# Altium schematic sheet Motherboard V2.0.SchDoc
size A3
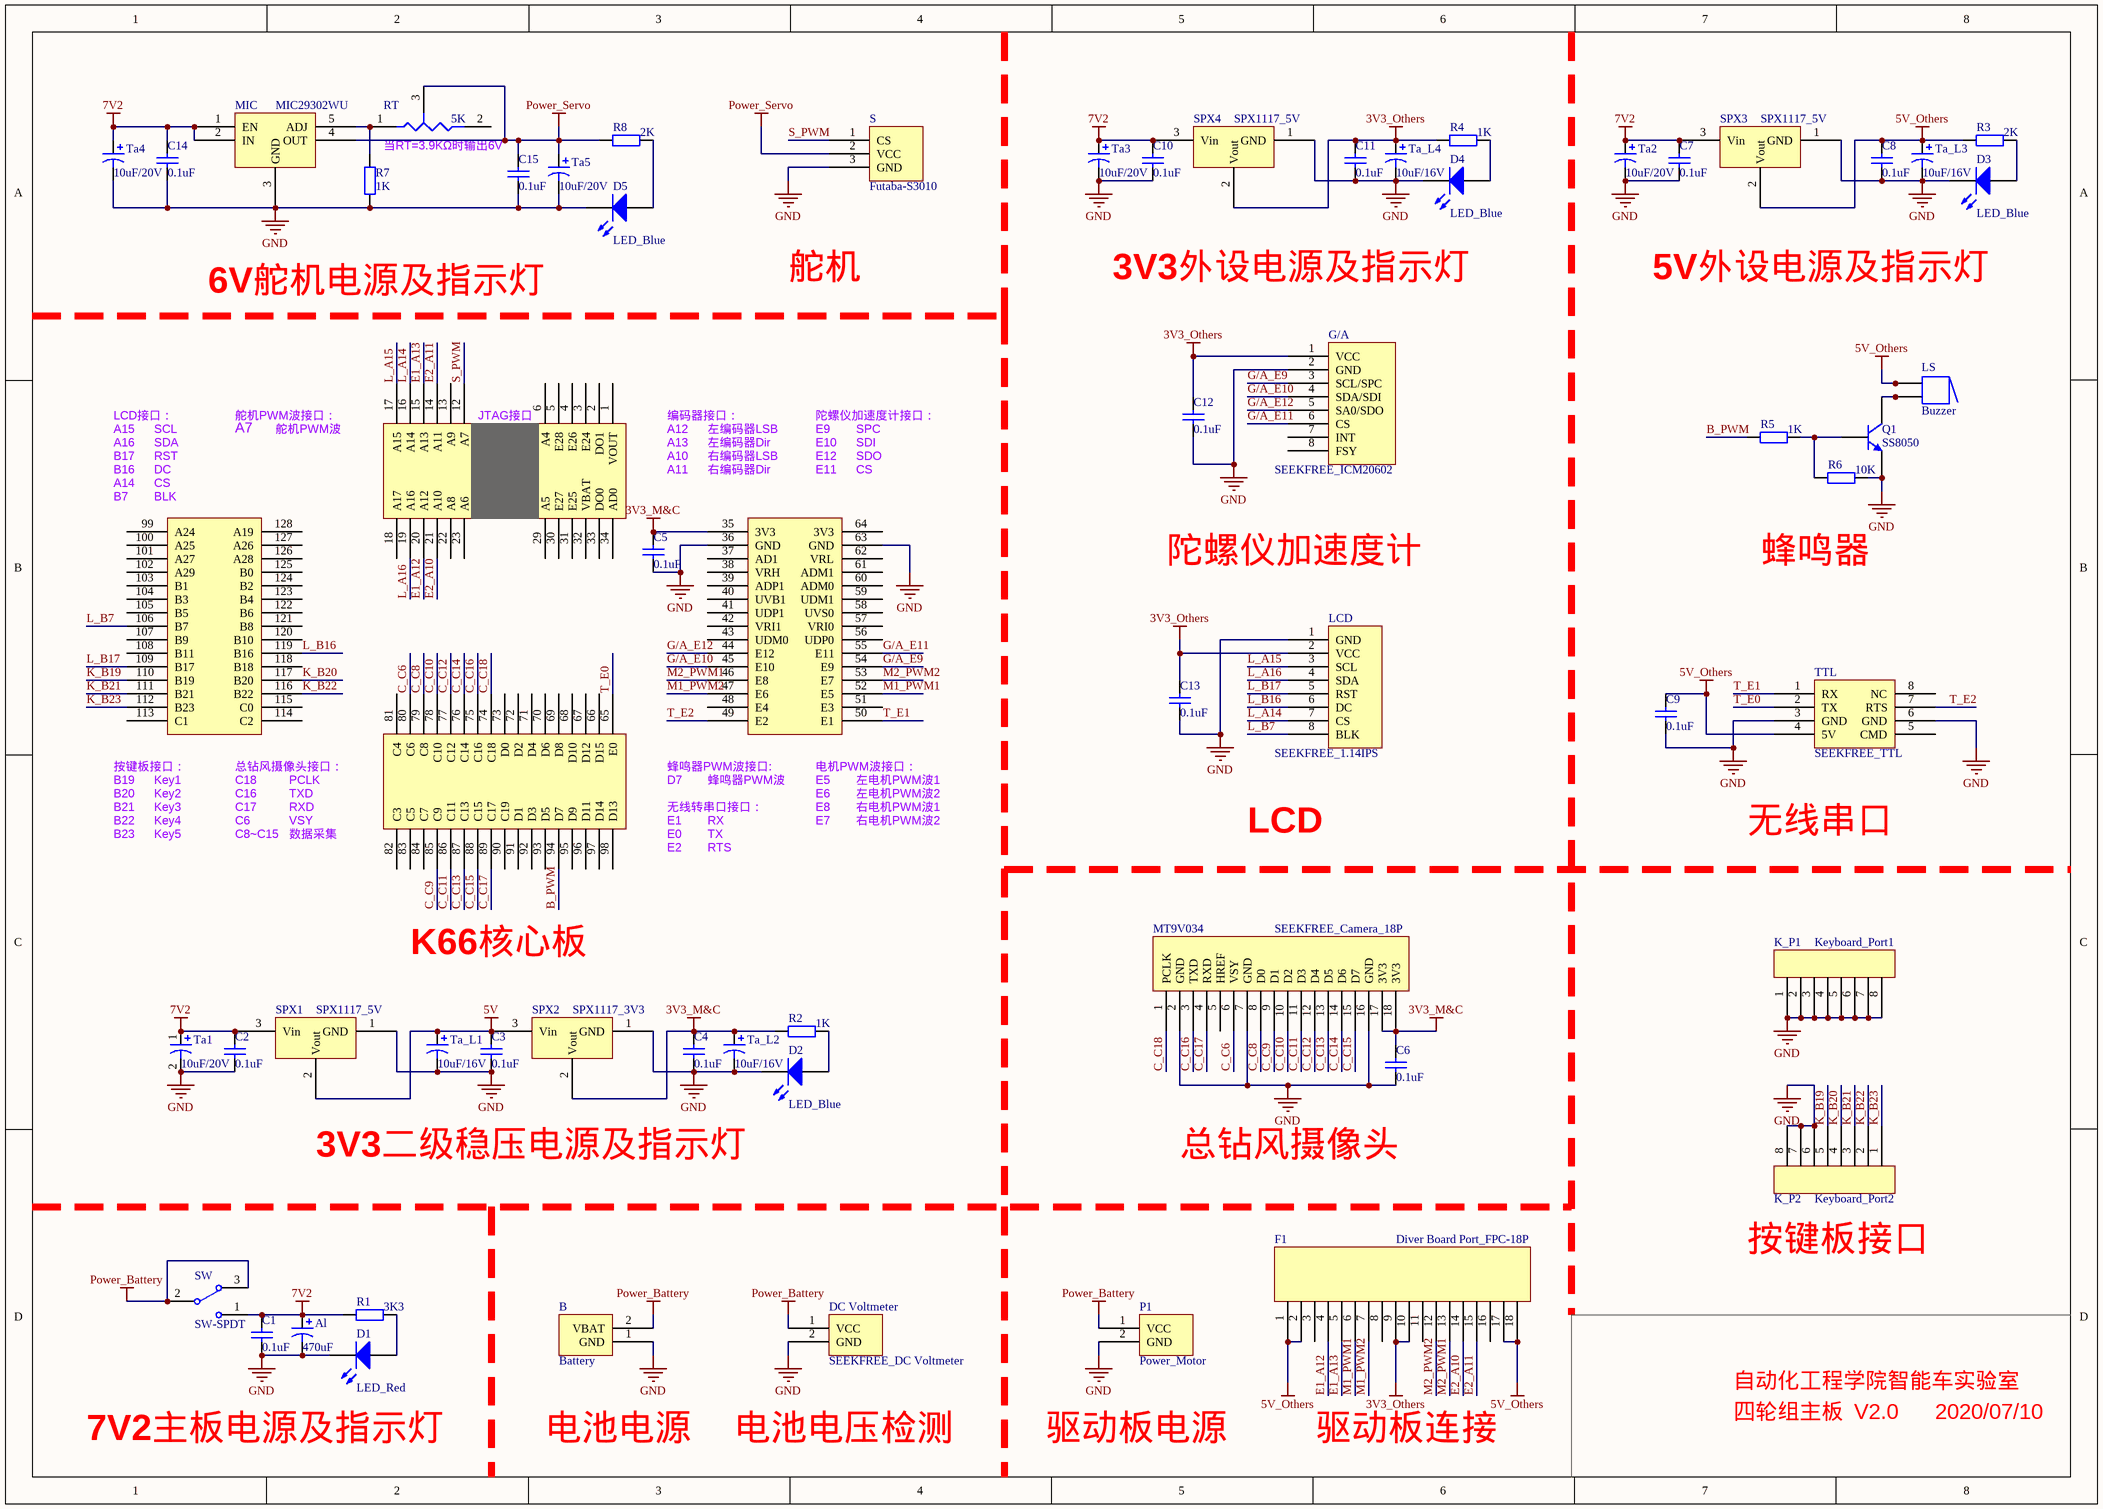
[diagram p0: Motherboard V2.0.SchDoc]

## Parts
Al  value 470uF  [C_AL_8*11.5MM]  (hidden comment: Cap Pol3)
B  Battery  [BATTERY_5MM]
C1  value 0.1uF  [C_0603]  (hidden comment: Cap)
C2  value 0.1uF  [C_0603]  (hidden comment: Cap)
C3  value 0.1uF  [C_0603]  (hidden comment: Cap)
C4  value 0.1uF  [C_0603]  (hidden comment: Cap)
C5  value 0.1uF  [C_0603]  (hidden comment: Cap)
C6  value 0.1uF  [C_0603]  (hidden comment: Cap)
C7  value 0.1uF  [C_0603]  (hidden comment: Cap)
C8  value 0.1uF  [C_0603]  (hidden comment: Cap)
C9  value 0.1uF  [C_0603]  (hidden comment: Cap)
C10  value 0.1uF  [C_0603]  (hidden comment: Cap)
C11  value 0.1uF  [C_0603]  (hidden comment: Cap)
C12  value 0.1uF  [C_0603]  (hidden comment: Cap)
C13  value 0.1uF  [C_0603]  (hidden comment: Cap)
C14  value 0.1uF  [C_0603]  (hidden comment: Cap)
C15  value 0.1uF  [C_0603]  (hidden comment: Cap)
D1  LED_Red  [LED_0603_R]
D2  LED_Blue  [LED_0603_B]
D3  LED_Blue  [LED_0603_B]
D4  LED_Blue  [LED_0603_B]
D5  LED_Blue  [LED_0603_B]
DC_Voltmeter  SEEKFREE_DC Voltmeter  [DC_VOLTMETER_5MM]
F1  Diver Board Port_FPC-18P  [DIVER BOARD PORT_0.5MM]
G/A  SEEKFREE_ICM20602  [G/A_8P_2.54MM]
K66  SEEKFERR_K66  [K66_BOARD_2.54MM]  (value not drawn)
K_P1  Keyboard_Port1  [Keyboard_Port1]
K_P2  Keyboard_Port2  [Keyboard_Port2]
LCD  SEEKFREE_1.14IPS  [LCD_8P_2.54MM]
LS  Buzzer  [BUZZER_5MM]
MIC  MIC29302WU  [MIC29302WU_TO263-5]
MT9V034  SEEKFREE_Camera_18P  [CAMERA_18P_0.5MM]
P1  Power_Motor  [POWER_MOTOR_5MM]
Q1  SS8050  [SS8050_SOT23-3]
R1  value 3K3  [R_0603]  (hidden comment: Res2)
R2  value 1K  [R_0603]  (hidden comment: Res2)
R3  value 2K  [R_0603]  (hidden comment: Res2)
R4  value 1K  [R_0603]  (hidden comment: Res2)
R5  value 1K  [R_0603]  (hidden comment: Res2)
R6  value 10K  [R_0603]  (hidden comment: Res2)
R7  value 1K  [R_0603]  (hidden comment: Res2)
R8  value 2K  [R_0603]  (hidden comment: Res2)
RT  value 5K  [R_ADJ_3296W]  (hidden comment: Res Tap)
S  Futaba-S3010  [Servo_2.54mm]
SPX1  SPX1117_5V  [SPX1117]
SPX2  SPX1117_3V3  [SPX1117]
SPX3  SPX1117_5V  [SPX1117]
SPX4  SPX1117_5V  [SPX1117]
SW  SW-SPDT  [SW_4.7mm]
Ta1  value 10uF/20V  [C_Ta_3528B]  (hidden comment: Cap Pol3)
Ta2  value 10uF/20V  [C_Ta_3528B]  (hidden comment: Cap Pol3)
Ta3  value 10uF/20V  [C_Ta_3528B]  (hidden comment: Cap Pol3)
Ta4  value 10uF/20V  [C_Ta_3528B]  (hidden comment: Cap Pol3)
Ta5  value 10uF/20V  [C_Ta_3528B]  (hidden comment: Cap Pol3)
Ta_L1  value 10uF/16V  [C_Ta_3216A]  (hidden comment: Cap Pol3)
Ta_L2  value 10uF/16V  [C_Ta_3216A]  (hidden comment: Cap Pol3)
Ta_L3  value 10uF/16V  [C_Ta_3216A]  (hidden comment: Cap Pol3)
Ta_L4  value 10uF/16V  [C_Ta_3216A]  (hidden comment: Cap Pol3)
TTL  SEEKFREE_TTL  [TTL_2*4P_2.54MM]

## Nets
3V3_M&C: C4.2 C5.2 C6.2 K66.35(3V3) MT9V034.17(3V3) MT9V034.18(3V3) R2.1 SPX2.2(Vout) Ta_L2.1
3V3_Others: C11.2 C12.2 C13.2 F1.9 F1.10 G/A.1(VCC) LCD.2(VCC) R4.1 SPX4.2(Vout) Ta_L4.1
5V: C3.2 SPX1.2(Vout) SPX2.3(Vin) Ta_L1.1
5V_Others: C8.2 C9.2 F1.1 F1.2 F1.17 F1.18 LS.1 LS.1A R3.1 SPX3.2(Vout) Ta_L3.1 TTL.4(5V)
7V2: Al.1 C1.2 C2.2 C7.2 C10.2 C14.2 MIC.1(EN) MIC.2(IN) R1.1 SPX1.3(Vin) SPX3.3(Vin) SPX4.3(Vin) SW.1 Ta1.1 Ta2.1 Ta3.1 Ta4.1
GND: Al.2 B.1(GND) C1.1 C2.1 C3.1 C4.1 C5.1 C6.1 C7.1 C8.1 C9.1 C10.1 C11.1 C12.1 C13.1 C14.1 C15.1 D1.2(K) D2.2(K) D3.2(K) D4.2(K) D5.2(K) DC_Voltmeter.2(GND) G/A.2(GND) K66.36(GND) K66.63(GND) K_P1.1 K_P1.2 K_P1.3 K_P1.4 K_P1.5 K_P1.6 K_P1.7 K_P1.8 K_P2.6 K_P2.7 K_P2.8 LCD.1(GND) MIC.3(GND) MT9V034.2(GND) MT9V034.7(GND) MT9V034.16(GND) P1.2(GND) Q1.3(E) R6.2 R7.1 S.3(GND) SPX1.1(GND) SPX2.1(GND) SPX3.1(GND) SPX4.1(GND) Ta1.2 Ta2.2 Ta3.2 Ta4.2 Ta5.2 Ta_L1.2 Ta_L2.2 Ta_L3.2 Ta_L4.2 TTL.3(GND) TTL.6(GND)
Power_Battery: B.2(VBAT) DC_Voltmeter.1(VCC) P1.1(VCC) SW.2 SW.3
Power_Servo: C15.2 MIC.4(OUT) R8.1 RT.3(TAP) S.2(VCC) Ta5.1
B_PWM: K66.94(D7) R5.1
C_C6: K66.80(C6) MT9V034.6(VSY)
C_C8: K66.79(C8) MT9V034.8(D0)
C_C9: K66.85(C9) MT9V034.9(D1)
C_C10: K66.78(C10) MT9V034.10(D2)
C_C11: K66.86(C11) MT9V034.11(D3)
C_C12: K66.77(C12) MT9V034.12(D4)
C_C13: K66.87(C13) MT9V034.13(D5)
C_C14: K66.76(C14) MT9V034.14(D6)
C_C15: K66.88(C15) MT9V034.15(D7)
C_C16: K66.75(C16) MT9V034.3(TXD)
C_C17: K66.89(C17) MT9V034.4(RXD)
C_C18: K66.74(C18) MT9V034.1(PCLK)
E1_A12: F1.4 K66.20(A12)
E1_A13: F1.5 K66.15(A13)
E2_A10: F1.14 K66.21(A10)
E2_A11: F1.15 K66.14(A11)
G/A_E9: G/A.3(SCL/SPC) K66.54(E9)
G/A_E10: G/A.4(SDA/SDI) K66.45(E10)
G/A_E11: G/A.6(CS) K66.55(E11)
G/A_E12: G/A.5(SA0/SDO) K66.44(E12)
K_B19: K66.110(B19) K_P2.5
K_B20: K66.117(B20) K_P2.4
K_B21: K66.111(B21) K_P2.3
K_B22: K66.116(B22) K_P2.2
K_B23: K66.112(B23) K_P2.1
L_A14: K66.16(A14) LCD.7(CS)
L_A15: K66.17(A15) LCD.3(SCL)
L_A16: K66.19(A16) LCD.4(SDA)
L_B7: K66.106(B7) LCD.8(BLK)
L_B16: K66.119(B16) LCD.6(DC)
L_B17: K66.109(B17) LCD.5(RST)
M1_PWM1: F1.6 K66.52(E5)
M1_PWM2: F1.7 K66.47(E6)
M2_PWM1: F1.13 K66.46(E8)
M2_PWM2: F1.12 K66.53(E7)
S_PWM: K66.12(A7) S.1(CS)
T_E0: K66.65(E0) TTL.2(TX)
T_E1: K66.50(E1) TTL.1(RX)
T_E2: K66.49(E2) TTL.7(RTS)
NetD1_1: D1.1(A) R1.2
NetD2_1: D2.1(A) R2.2
NetD3_1: D3.1(A) R3.2
NetD4_1: D4.1(A) R4.2
NetD5_1: D5.1(A) R8.2
NetLS_2: LS.2 LS.2A Q1.1(C)
NetMIC_5: MIC.5(ADJ) R7.2 RT.1(A)
NetQ1_2: Q1.2(B) R5.2 R6.1

Not connected (* = marked no-connect by the designer): F1 3 8 11 16; G/A 7(INT) 8(FSY); K66 1(VOUT) 2(DO1) 3(E24) 4(E26) 5(E28) 6(A4) 13(A9) 18(A17) 22(A8) 23(A6) 29(A5) 30(E27) 31(E25) 32(VBAT) 33(DO0) 34(AD0) 37(AD1) 38(VRH) 39(ADP1) 40(UVB1) 41(UDP1) 42(VRI1) 43(UDM0) 48(E4) 51(E3) 56(UDP0) 57(VRI0) 58(UVS0) 59(UDM1) 60(ADM0) 61(ADM1) 62(VRL) 64(3V3) 66(D15) 67(D12) 68(D10) 69(D8) 70(D6) 71(D4) 72(D2) 73(D0) 81(C4) 82(C3) 83(C5) 84(C7) 90(C19) 91(D1) 92(D3) 93(D5) 95(D9) 96(D11) 97(D14) 98(D13) 99(A24) 100(A25) 101(A27) 102(A29) 103(B1) 104(B3) 105(B5) 107(B9) 108(B11) 113(C1) 114(C2) 115(C0) 118(B18) 120(B10) 121(B8) 122(B6) 123(B4) 124(B2) 125(B0) 126(A28) 127(A26) 128(A19); MT9V034 5(HREF); RT 2(B); TTL 5(CMD) 8(NC)

## Notes on the sheet
- 当RT=3.9KΩ时输出6V
- 6V舵机电源及指示灯
- 舵机
- 3V3外设电源及指示灯
- 5V外设电源及指示灯
- (near K66) LCD接口：
- (near K66) A15
- (near K66) A16
- (near K66) SCL
- (near K66) SDA
- (near K66) 舵机PWM波接口：
- (near K66) A7
- (near K66) 舵机PWM波
- (near K66) JTAG接口
- (near K66) 编码器接口：
- (near K66) A12
- (near K66) A13
- (near K66) 左编码器LSB
- (near K66) 左编码器Dir
- (near K66) 陀螺仪加速度计接口：
- (near K66) E9
- (near K66) E10
- (near K66) SPC
- (near K66) SDI
- (near K66) B17
- (near K66) B16
- (near K66) A14
- (near K66) B7
- (near K66) RST
- (near K66) DC
- (near K66) CS
- (near K66) BLK
- (near K66) A10
- (near K66) A11
- (near K66) 右编码器LSB
- (near K66) 右编码器Dir
- (near K66) E12
- (near K66) E11
- (near K66) SDO
- 陀螺仪加速度计
- 蜂鸣器
- (near K66) 按键板接口：
- (near K66) B19
- (near K66) Key1
- (near K66) 总钻风摄像头接口：
- (near K66) C18
- (near K66) PCLK
- (near K66) 蜂鸣器PWM波接口:
- (near K66) D7
- (near K66) 蜂鸣器PWM波
- (near K66) 电机PWM波接口：
- (near K66) E5
- (near K66) 左电机PWM波1
- (near K66) B20
- (near K66) B21
- (near K66) B22
- (near K66) B23
- (near K66) Key2
- (near K66) Key3
- (near K66) Key4
- (near K66) Key5
- (near K66) C16
- (near K66) C17
- (near K66) C6
- (near K66) C8~C15
- (near K66) TXD
- (near K66) RXD
- (near K66) VSY
- (near K66) 数据采集
- (near K66) 无线转串口接口：
- (near K66) E1
- (near K66) E2
- (near K66) E0
- (near K66) RX
- (near K66) TX
- (near K66) RTS
- (near K66) E6
- (near K66) E8
- (near K66) E7
- (near K66) 左电机PWM波2
- (near K66) 右电机PWM波1
- (near K66) 右电机PWM波2
- LCD
- 无线串口
- K66核心板
- 3V3二级稳压电源及指示灯
- 总钻风摄像头
- 按键板接口
- 自动化工程学院智能车实验室
- 7V2主板电源及指示灯
- 电池电源
- 电池电压检测
- 驱动板电源
- 驱动板连接
- 四轮组主板
- V2.0
- 2020/07/10

## Library data of the parts
Al Ta1-Ta5 Ta_L1-Ta_L4 = Cap Pol3: Polarized Capacitor (Surface Mount); Published: 8-Jun-2000; LatestRevisionDate: 29-May-2009; LatestRevisionNote: IPC-7351 Footprint Added.; PackageReference: C0805; Publisher: Altium Limited; PackageDescription: Chip Capacitor
C1-C15 = Cap: Capacitor; Published: 8-Jun-2000; LatestRevisionDate: 17-Jul-2002; LatestRevisionNote: Re-released for DXP Platform.; PackageReference: RAD-0.3; Publisher: Altium Limited; PackageDescription: Radial Cap, Thru-Hole; 2 Leads; 0.3 in Pin Spacing
D1-D5 = LED3: Typical BLUE SiC LED; Published: 8-Jun-2000; LatestRevisionDate: 17-Dec-2003; LatestRevisionNote: PCB Footprint replaced.; DatasheetVersion: 16-Apr-2002; PackageVersion: 16-Apr-2002; PackageReference: 3.5X2.8X1.9; Publisher: Altium Limited; PackageDescription: SM LED; 2 C-Bend Leads; Body 3.5 x 2.8 x 1.9 mm, inc leads (LxWxH typ)
F1 = Diver Board Port
G/A = SEEKFREE_G/A
LCD = SEEKFREE_LCD
LS = Buzzer: Magnetic Transducer Buzzer; Published: 24-Mar-1999; LatestRevisionDate: 17-Dec-2003; LatestRevisionNote: Schematic revised, PCB Footprint replaced.; DatasheetVersion: 17-Dec-2003; PackageReference: ABSM-1574; Publisher: Altium Limited; PackageDescription: Magnetic Transducer Buzzer; ComponentLink1Description: Manufacturer Link; ComponentLink1URL: http://www.megastar.com/linecard/buzzmode/index.php
MIC = MIC29302
MT9V034 = SEEKFREE_Camera
Q1 = NPN: NPN Bipolar Transistor; Published: 8-Jun-2000; LatestRevisionDate: 17-Jul-2002; LatestRevisionNote: Re-released for DXP Platform.; PackageReference: TO-226-AA; Publisher: Altium Limited; PackageDescription: TO, Flat Index; 3 In-Line, Axial Leads; Body Dia. 4.8mm; Leads 0.55 x 0.51 mm (max); Code_JEDEC: TO-226-AA
R1-R8 = Res2: Resistor; Published: 8-Jun-2000; LatestRevisionDate: 17-Jul-2002; LatestRevisionNote: Re-released for DXP Platform.; PackageReference: AXIAL-0.4; Publisher: Altium Limited; PackageDescription: Axial Device, Thru-Hole; 2 Leads; 0.4 in Pin Spacing
RT = Res Tap: Tapped Resistor; Sim Note: Enter the Resistance value and the set point into parameter fields.; Set Position: 0.5; Published: 24-Mar-1999; LatestRevisionDate: 17-Jul-2002; LatestRevisionNote: Re-released for DXP Platform.; PackageReference: VR3; Publisher: Altium Limited; PackageDescription: Variable Resistor, Thru-Hole; 3 Leads
S = Servo
SW = SW-SPDT: SPDT Subminiature Toggle Switch, Right Angle Mounting, Vertical Actuation; Published: 24-Mar-1999; LatestRevisionDate: 17-Dec-2003; LatestRevisionNote: Schematic revised, PCB Footprint replaced.; DatasheetVersion: 05-Dec-2000; PackageReference: TL36WW15050; Publisher: Altium Limited; PackageDescription: Switch; 4 Leads; ComponentLink1Description: Manufacturer Link; ComponentLink1URL: http://www.apem.com